# EAGLE schematic esp8266_network_speaker (EAGLE 7.7.0)
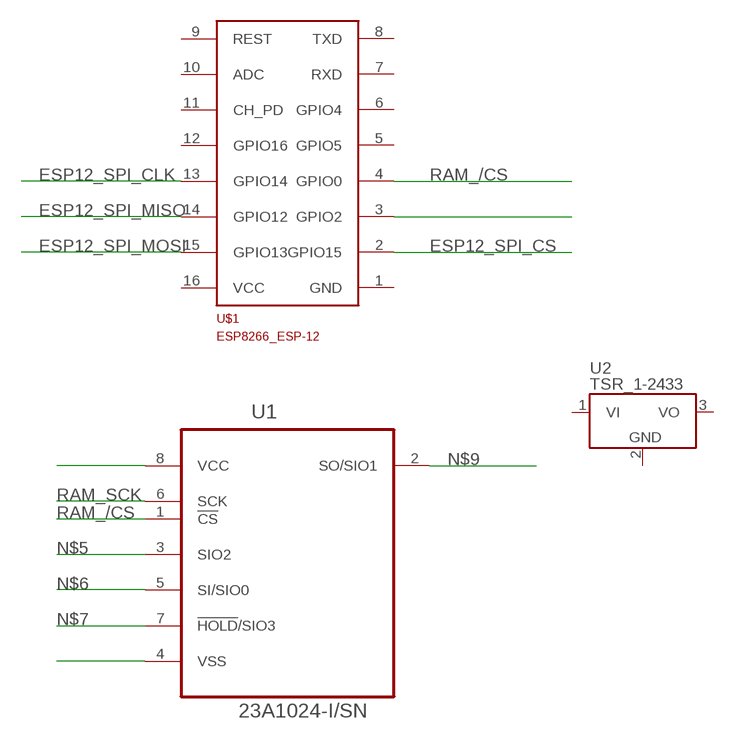
[diagram p0: schematic, sheet 1]

## Parts
U1  23A1024-I/SN  [SOIC127P600X175-8N]
U2  TSR_1-2433  [TSR-1]
U$1  ESP8266_ESP-12  [ESP8266-ESP12]

## Nets
ESP12_SPI_CLK: U$1.13(GPIO14)
ESP12_SPI_CS: U$1.2(GPIO15)
ESP12_SPI_MISO: U$1.14(GPIO12)
ESP12_SPI_MOSI: U$1.15(GPIO13)
N$1: U$1.3(GPIO2)
N$4: U1.8(VCC)
N$5: U1.3(SIO2)
N$6: U1.5(SI/SIO0)
N$7: U1.7(!HOLD!/SIO3)
N$8: U1.4(VSS)
N$9: U1.2(SO/SIO1)
RAM_/CS: U1.1(!CS) U$1.4(GPIO0)
RAM_SCK: U1.6(SCK)
Unconnected: U2.1(VI) U$1.1(GND) U$1.5(GPIO5) U$1.6(GPIO4) U$1.7(RXD) U$1.8(TXD) U$1.9(REST) U$1.10(ADC) U$1.11(CH_PD) U$1.12(GPIO16) U$1.16(VCC)

## Power pins joined to a net without a drawn wire
GND: U2.2(GND)
VO: U2.3(VO)

## Library data of the parts
U1 = 23A1024:23A1024-I/SN: 1Mbit SPI Serial SRAM,SOIC-8; MPN: 23A1024-I/SN; OC_FARNELL: 2212147; OC_NEWARK: 94T8191; PACKAGE: SOIC-8; SUPPLIER: MICROCHIP
U2 = _traco_tsr-1:TSR_1-*: TRACO TSR-1 Series Point-of-Load DC/DC-Converters Vi max. 36 V; Vo = (1.2 .. 15)V ±2%; Io = 0 .. 1 A SIP-Package (drop-in replacement for 78xx linear voltage regulators in TO220-package, vertically assembled) Source: www.tracopower.com Technologies: TSR 1- Vi (V) Vo (V) ±2% Io = 0 .. 1 A 24_ ( generic ) 2412 4.6 .. 36 1.2 2415 4.6 .. 36 1.5 2418 4.6 .. 36 1.8 2425 4.6 .. 36 2.5 2433 4.75.. 36 3.3 2450 6.5 .. 36 5.0 2465 9.0 .. 36 6.5 2490 12 .. 36 9.0 24120 15 .. 36 12 24150 18 .. 36 15 Author: Dipl.-Ing. FH Rainer Bayer HHN Hochschule Heilbronn, rainer.bayer@hs-heilbronn.de Ingenieurbüro ing-rb, mail@ing-rb.de
U$1 = ESP8266-ESP12:ESP8266_ESP-12